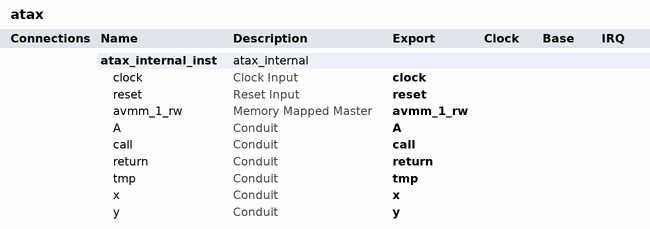
[diagram p0: system contents]
# Platform Designer (Qsys) system atax, Cyclone V 5CSEMA4U23C7
# Parameters at their usual value, and those the tool derives, are not listed.
package require qsys
create_system atax
set_project_property DEVICE_FAMILY {Cyclone V}
set_project_property DEVICE 5CSEMA4U23C7

add_instance atax_internal_inst atax_internal 1.0
set_instance_property atax_internal_inst AUTO_EXPORT true

# exported interfaces
add_interface A conduit end
set_interface_property A EXPORT_OF atax_internal_inst.A
add_interface avmm_1_rw avalon master
set_interface_property avmm_1_rw EXPORT_OF atax_internal_inst.avmm_1_rw
add_interface call conduit end
set_interface_property call EXPORT_OF atax_internal_inst.call
add_interface clock clock sink
set_interface_property clock EXPORT_OF atax_internal_inst.clock
add_interface reset reset sink
set_interface_property reset EXPORT_OF atax_internal_inst.reset
add_interface return conduit end
set_interface_property return EXPORT_OF atax_internal_inst.return
add_interface tmp conduit end
set_interface_property tmp EXPORT_OF atax_internal_inst.tmp
add_interface x conduit end
set_interface_property x EXPORT_OF atax_internal_inst.x
add_interface y conduit end
set_interface_property y EXPORT_OF atax_internal_inst.y

set_interconnect_requirement {$system} qsys_mm.clockCrossingAdapter HANDSHAKE
set_interconnect_requirement {$system} qsys_mm.enableEccProtection FALSE
set_interconnect_requirement {$system} qsys_mm.insertDefaultSlave FALSE
set_interconnect_requirement {$system} qsys_mm.maxAdditionalLatency 1

save_system atax.qsys
